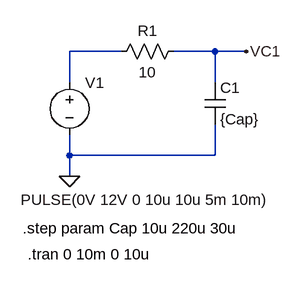
[diagram p0: schematic E5-parametrico.asc]
E5-parametrico.asc, the LTspice schematic file:
Version 4
SHEET 1 880 680
WIRE -720 -272 -800 -272
WIRE -576 -272 -640 -272
WIRE -528 -272 -576 -272
WIRE -800 -224 -800 -272
WIRE -576 -224 -576 -272
WIRE -800 -112 -800 -144
WIRE -576 -112 -576 -160
WIRE -576 -112 -800 -112
WIRE -800 -80 -800 -112
FLAG -800 -80 0
FLAG -528 -272 VC1
SYMBOL voltage -800 -240 R0
WINDOW 3 -75 196 Left 2
WINDOW 123 26 97 Left 2
WINDOW 39 0 0 Left 0
SYMATTR InstName V1
SYMATTR Value PULSE(0V 12V 0 10u 10u 5m 10m)
SYMBOL res -624 -288 R90
WINDOW 0 0 56 VBottom 2
WINDOW 3 32 56 VTop 2
SYMATTR InstName R1
SYMATTR Value 10
SYMBOL cap -592 -224 R0
SYMATTR InstName C1
SYMATTR Value {Cap}
TEXT -872 0 Left 2 !.step param Cap 10u 220u 30u
TEXT -864 40 Left 2 !.tran 0 10m 0 10u

The netlist it stands for:
* E5-parametrico.asc
V1 N001 0 PULSE(0V 12V 0 10u 10u 5m 10m)
R1 VC1 N001 10
C1 VC1 0 {Cap}
.step param Cap 10u 220u 30u
.tran 0 10m 0 10u
.backanno
.end